# Altium schematic sheet TSAL_Schematic.SchDoc
size A4
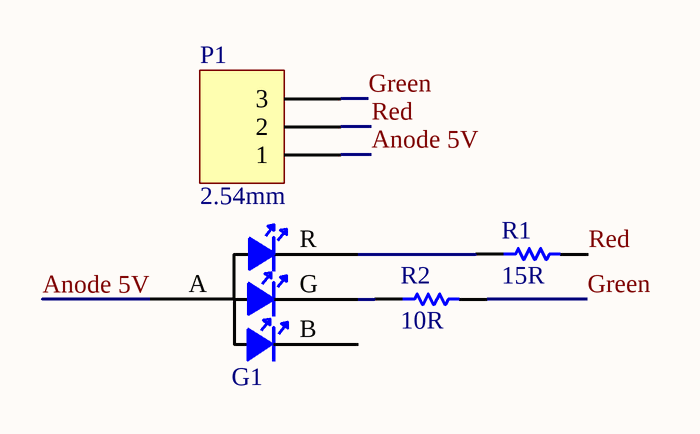
[diagram p0: TSAL_Schematic.SchDoc]

## Parts
G1  G  [HOTRED RGB_LED]  (value not drawn)
P1  2.54mm  [TH 2.54mm Header 1x3]
R1  15R  [2512]
R2  10R  [2512]

## Nets
Anode 5V: G1.A P1.1
Green: P1.3 R2.2
Red: P1.2 R1.2
NetG1_G: G1.G R2.1
NetG1_R: G1.R R1.1

Not connected (* = marked no-connect by the designer): G1 B

## Library data of the parts
G1 = LED - RGB (Anode Common)
P1 = TH 2.54mm Header 1x3: Positions: 3; Angle: 0; Flange: No; Contact: NA; Part Number: TH 2.54mm Header 1x3; Pitch: 2.54mm; Row Spacing: 2.54mm
R1 = 352115RFT: Manufacturer: TE Connectivity; Tolerance: 0.01; Rated Voltage: 2W; Part Number: 352115RFT; Value: 15R; Digikey Part Number: A115988CT-ND
R2 = 352110RFT: Manufacturer: TE Connectivity; Tolerance: 0.01; Rated Voltage: 2W; Part Number: 352110RFT; Value: 10R; Digikey Part Number: A115984CT-ND